# Altium project BMS_Link_Rev0.PrjPcb
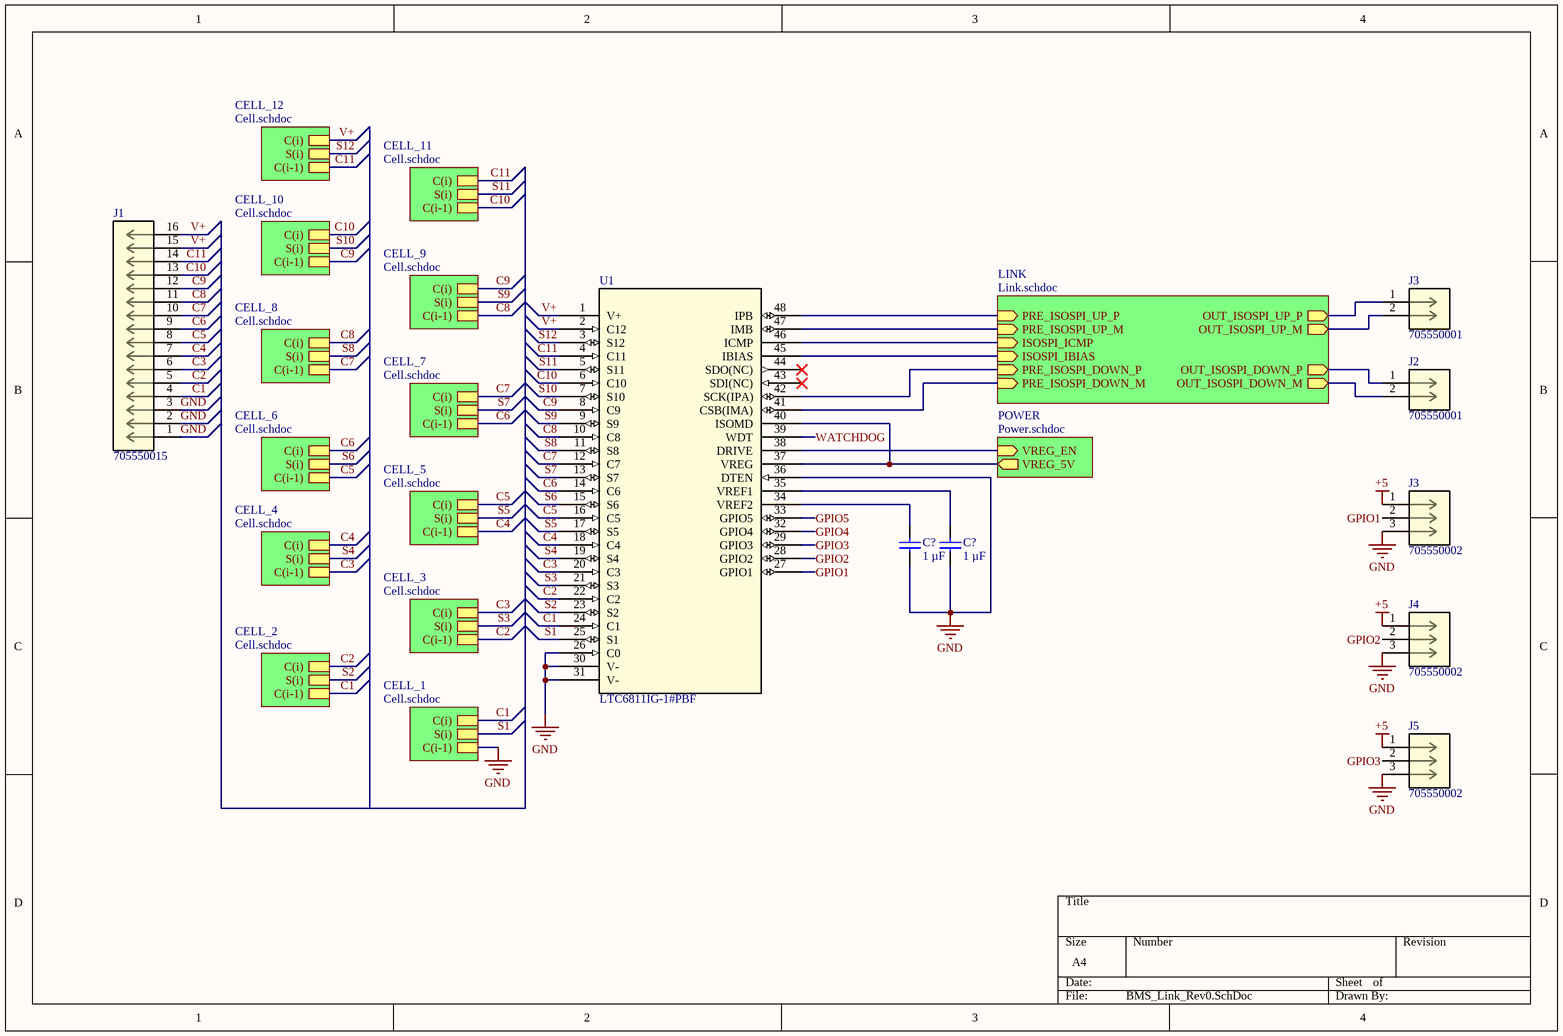
[diagram p0: BMS_Link_Rev0.SchDoc]
4 sheets, 101 parts. Net scope: hierarchical (ports join the sheet entries above them; power ports are global).
Board file: BMS_Link_Rev0.PcbDoc
Sheets:
  BMS_Link_Rev0.SchDoc
    CELL_11 = Cell.SchDoc
    CELL_9 = Cell.SchDoc
    CELL_7 = Cell.SchDoc
    CELL_5 = Cell.SchDoc
    CELL_3 = Cell.SchDoc
    CELL_1 = Cell.SchDoc
    CELL_12 = Cell.SchDoc
    CELL_10 = Cell.SchDoc
    CELL_8 = Cell.SchDoc
    CELL_6 = Cell.SchDoc
    CELL_4 = Cell.SchDoc
    CELL_2 = Cell.SchDoc
    POWER = Power.SchDoc
    LINK = Link.SchDoc

## Sheet BMS_Link_Rev0.SchDoc
size A4; SheetNumber: 1; SheetTotal: 3

### Parts
(Parts that share a designator on the sheet are numbered #1, #2 ... from top to bottom, then left to right.)
C?#1  value 1 µF  [0805_CAPACITOR]  (hidden comment: CL21B105KAFNNNE)
C?#2  value 1 µF  [0805_CAPACITOR]  (hidden comment: CL21B105KAFNNNE)
J1  705550015  [MOLEX-CON-16P-705550000]
J2  705550001  [CONN_705550000-SD_02_MOL]
J3#1  705550001  [CONN_705550000-SD_02_MOL]
J3#2  705550002  [CONN_705550000-SD_03_MOL]
J4  705550002  [CONN_705550000-SD_03_MOL]
J5  705550002  [CONN_705550000-SD_03_MOL]
U1  LTC6811IG-1#PBF  [48-SSOP]

### Sub-sheets
CELL_1 = Cell.schdoc: C(i), C(i-1), S(i)
CELL_2 = Cell.schdoc: C(i), C(i-1), S(i)
CELL_3 = Cell.schdoc: C(i), C(i-1), S(i)
CELL_4 = Cell.schdoc: C(i), C(i-1), S(i)
CELL_5 = Cell.schdoc: C(i), C(i-1), S(i)
CELL_6 = Cell.schdoc: C(i), C(i-1), S(i)
CELL_7 = Cell.schdoc: C(i), C(i-1), S(i)
CELL_8 = Cell.schdoc: C(i), C(i-1), S(i)
CELL_9 = Cell.schdoc: C(i), C(i-1), S(i)
CELL_10 = Cell.schdoc: C(i), C(i-1), S(i)
CELL_11 = Cell.schdoc: C(i), C(i-1), S(i)
CELL_12 = Cell.schdoc: C(i), C(i-1), S(i)
LINK = Link.schdoc: PRE_ISOSPI_UP_P (in), PRE_ISOSPI_UP_M (in), ISOSPI_ICMP (in), ISOSPI_IBIAS (in), PRE_ISOSPI_DOWN_P (in), PRE_ISOSPI_DOWN_M (in), OUT_ISOSPI_UP_P (out), OUT_ISOSPI_UP_M (out), OUT_ISOSPI_DOWN_P (out), OUT_ISOSPI_DOWN_M (out)
POWER = Power.schdoc: VREG_EN (in), VREG_5V (out)

### Nets
+5: J3#2.1 J4.1 J5.1 U1.37(VREG) U1.40(ISOMD) ; sheet POWER/VREG_5V
GND: C?#1.2 C?#2.2 J1.1 J1.2 J1.3 J3#2.3 J4.3 J5.3 U1.26(C0) U1.30(V-) U1.31(V-) U1.36(DTEN) ; sheet CELL_1/C(i-1)
C1: J1.4 U1.24(C1) ; sheet CELL_1/C(i), sheet CELL_2/C(i-1)
C2: J1.5 U1.22(C2) ; sheet CELL_3/C(i-1), sheet CELL_2/C(i)
C3: J1.6 U1.20(C3) ; sheet CELL_3/C(i), sheet CELL_4/C(i-1)
C4: J1.7 U1.18(C4) ; sheet CELL_5/C(i-1), sheet CELL_4/C(i)
C5: J1.8 U1.16(C5) ; sheet CELL_5/C(i), sheet CELL_6/C(i-1)
C6: J1.9 U1.14(C6) ; sheet CELL_7/C(i-1), sheet CELL_6/C(i)
C7: J1.10 U1.12(C7) ; sheet CELL_7/C(i), sheet CELL_8/C(i-1)
C8: J1.11 U1.10(C8) ; sheet CELL_9/C(i-1), sheet CELL_8/C(i)
C9: J1.12 U1.8(C9) ; sheet CELL_9/C(i), sheet CELL_10/C(i-1)
C10: J1.13 U1.6(C10) ; sheet CELL_11/C(i-1), sheet CELL_10/C(i)
C11: J1.14 U1.4(C11) ; sheet CELL_11/C(i), sheet CELL_12/C(i-1)
GPIO1: J3#2.2 U1.27(GPIO1)
GPIO2: J4.2 U1.28(GPIO2)
GPIO3: J5.2 U1.29(GPIO3)
GPIO4: U1.32(GPIO4)
GPIO5: U1.33(GPIO5)
ISOSPI_IBIAS: U1.45(IBIAS) ; sheet LINK/ISOSPI_IBIAS
ISOSPI_ICMP: U1.46(ICMP) ; sheet LINK/ISOSPI_ICMP
PRE_ISOSPI_DOWN_M: J2.2 U1.41(CSB(IMA)) ; sheet LINK/PRE_ISOSPI_DOWN_M, sheet LINK/OUT_ISOSPI_DOWN_M
PRE_ISOSPI_DOWN_P: J2.1 U1.42(SCK(IPA)) ; sheet LINK/PRE_ISOSPI_DOWN_P, sheet LINK/OUT_ISOSPI_DOWN_P
PRE_ISOSPI_UP_M: J3#1.2 U1.47(IMB) ; sheet LINK/PRE_ISOSPI_UP_M, sheet LINK/OUT_ISOSPI_UP_M
PRE_ISOSPI_UP_P: J3#1.1 U1.48(IPB) ; sheet LINK/PRE_ISOSPI_UP_P, sheet LINK/OUT_ISOSPI_UP_P
S1: U1.25(S1) ; sheet CELL_1/S(i)
S2: U1.23(S2) ; sheet CELL_2/S(i)
S3: U1.21(S3) ; sheet CELL_3/S(i)
S4: U1.19(S4) ; sheet CELL_4/S(i)
S5: U1.17(S5) ; sheet CELL_5/S(i)
S6: U1.15(S6) ; sheet CELL_6/S(i)
S7: U1.13(S7) ; sheet CELL_7/S(i)
S8: U1.11(S8) ; sheet CELL_8/S(i)
S9: U1.9(S9) ; sheet CELL_9/S(i)
S10: U1.7(S10) ; sheet CELL_10/S(i)
S11: U1.5(S11) ; sheet CELL_11/S(i)
S12: U1.3(S12) ; sheet CELL_12/S(i)
V+: J1.15 J1.16 U1.1(V+) U1.2(C12) ; sheet CELL_12/C(i)
WATCHDOG: U1.39(WDT)
NetC?#1_1: C?#1.1 U1.34(VREF2)
NetC?#2_1: C?#2.1 U1.35(VREF1)
NetU1_38: U1.38(DRIVE) ; sheet POWER/VREG_EN

Not connected (* = marked no-connect by the designer): U1 43(SDI(NC))* 44(SDO(NC))*

### Library data of the parts
C?#1 C?#2 = CL21B105KAFNNNE: 1 µF ±10% 25V Ceramic Capacitor X7R 0805 (2012 Metric)
J1 = 705550015: 2.54mm Pitch SL Header, Single Row, Right Angle, 3.05mm Pocket, Shrouded, with Press-fit Plastic Peg, 16 Circuits, Tin (Sn) Plating; Manufacturer_Name: Molex Connector Corporation; Copyright: Copyright (C) 2025 Ultra Librarian. All rights reserved.; Manufacturer_Part_Number: 705550015; Datasheet: https://www.molex.com/en-us/products/part-detail-pdf/705550015?display=pdf; RefDes: RefDes; Type: Type
J2 J3#1 = 705550001: 2.54mm Pitch SL Header, Single Row, Right Angle, 3.05mm Pocket, Shrouded, with Press-fit Plastic Peg, 2 Circuits, Tin (Sn) Plating; Manufacturer_Name: Molex Connector Corporation; Copyright: Copyright (C) 2025 Ultra Librarian. All rights reserved.; Manufacturer_Part_Number: 705550001; Datasheet: https://www.molex.com/en-us/products/part-detail-pdf/705550001?display=pdf; RefDes: RefDes; Type: Type
J3#2 J4 J5 = 705550002: 2.54mm Pitch SL Header, Single Row, Right Angle, 3.05mm Pocket, Shrouded, with Press-fit Plastic Peg, 3 Circuits, Tin (Sn) Plating; Manufacturer_Name: Molex Connector Corporation; Copyright: Copyright (C) 2025 Ultra Librarian. All rights reserved.; Manufacturer_Part_Number: 705550002; Datasheet: https://www.molex.com/en-us/products/part-detail-pdf/705550002?display=pdf; RefDes: RefDes; Type: Type
U1 = LTC6811IG-1PBF: 12 Channel Multicell Battery Monitor with Daisy Chain Interface, Generation 4; Manufacturer_Name: Analog Devices Inc; Type: Power Management; Copyright: Copyright (C) 2025 Ultra Librarian. All rights reserved.; Manufacturer_Part_Number: LTC6811IG-1#PBF; Datasheet: https://www.analog.com/media/en/technical-documentation/data-sheets/LTC6811-1-6811-2.pdf; RefDes: RefDes

## Sheet Cell.SchDoc
size A4; SheetNumber: 3; SheetTotal: 4
Used 12 times, as channels CELL_11, CELL_9, CELL_7, CELL_5, CELL_3, CELL_1, CELL_12, CELL_10, CELL_8, CELL_6, CELL_4, CELL_2. Parts and nets are listed once, with the designators drawn on the sheet.
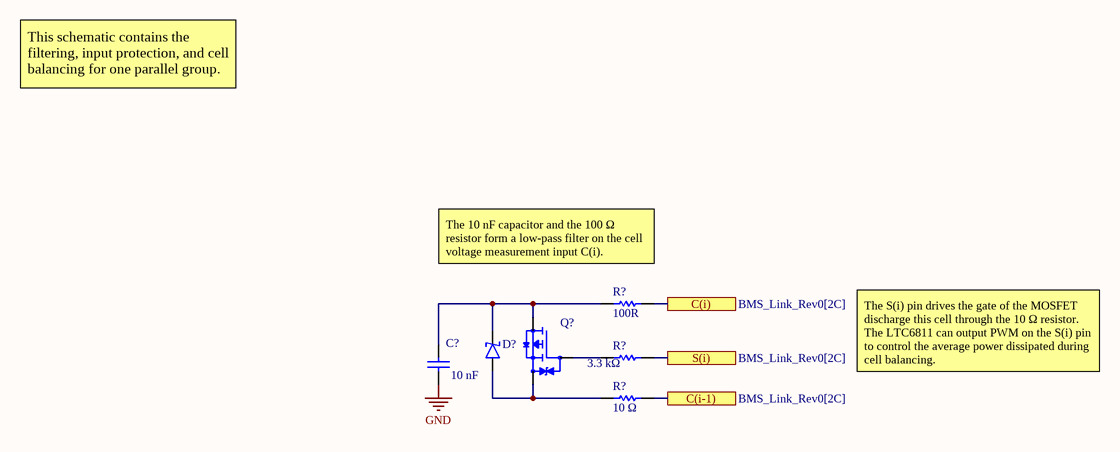
[diagram p1: Cell.SchDoc]

### Parts
(Parts that share a designator on the sheet are numbered #1, #2 ... from top to bottom, then left to right.)
C?  value 10 nF  [0805_CAPACITOR]  (hidden comment: CL21B103KBANNNC)
D?  SMAZ6V8-13-F  [SMA_DO-214AC_DIODE]  (value not drawn)
Q?  BSS308PE  [TRANS_SOT23]  (value not drawn)
R?#1  value 100R  [0805_RESISTOR]  (hidden comment: ERA-6AEB101V)
R?#2  value 3.3 kΩ  [0805_RESISTOR]  (hidden comment: RC0805FR-073K3L)
R?#3  value 10 Ω  [RES_3540_TEC-M]  (hidden comment: 354010RFT)

### Ports
C(i) (see BMS_Link_Rev0[2C]), C(i-1) (see BMS_Link_Rev0[2C]), S(i) (see BMS_Link_Rev0[2C])

### Nets
GND: C?.2
C(i): R?#1.2 ; port C(i)
C(i-1): R?#3.1 ; port C(i-1)
S(i): R?#2.1 ; port S(i)
NetC?_1: C?.1 D?.2(K) Q?.3(D) R?#1.1
NetD?_1: D?.1(A) Q?.2(S) R?#3.2
NetQ?_1: Q?.1(G) R?#2.2

### Channels
CELL_11: designators C?=C?_1 D?=D?_1 Q?=Q?_1 R?=R?_1#3 R?=R?_1#1 R?=R?_1#2; ports C(i)=C11 C(i-1)=C10 S(i)=S11
CELL_9: designators C?=C?_2 D?=D?_2 Q?=Q?_2 R?=R?_2#3 R?=R?_2#1 R?=R?_2#2; ports C(i)=C9 C(i-1)=C8 S(i)=S9
CELL_7: designators C?=C?_3 D?=D?_3 Q?=Q?_3 R?=R?_3#3 R?=R?_3#1 R?=R?_3#2; ports C(i)=C7 C(i-1)=C6 S(i)=S7
CELL_5: designators C?=C?_4 D?=D?_4 Q?=Q?_4 R?=R?_4#3 R?=R?_4#1 R?=R?_4#2; ports C(i)=C5 C(i-1)=C4 S(i)=S5
CELL_3: designators C?=C?_5 D?=D?_5 Q?=Q?_5 R?=R?_5#3 R?=R?_5#1 R?=R?_5#2; ports C(i)=C3 C(i-1)=C2 S(i)=S3
CELL_1: designators C?=C?_6 D?=D?_6 Q?=Q?_6 R?=R?_6#3 R?=R?_6#1 R?=R?_6#2; ports C(i)=C1 C(i-1)=GND S(i)=S1
CELL_12: designators C?=C?_7 D?=D?_7 Q?=Q?_7 R?=R?_7#3 R?=R?_7#1 R?=R?_7#2; ports C(i)=V+ C(i-1)=C11 S(i)=S12
CELL_10: designators C?=C?_8 D?=D?_8 Q?=Q?_8 R?=R?_8#3 R?=R?_8#1 R?=R?_8#2; ports C(i)=C10 C(i-1)=C9 S(i)=S10
CELL_8: designators C?=C?_9 D?=D?_9 Q?=Q?_9 R?=R?_9#3 R?=R?_9#1 R?=R?_9#2; ports C(i)=C8 C(i-1)=C7 S(i)=S8
CELL_6: designators C?=C?_10 D?=D?_10 Q?=Q?_10 R?=R?_10#3 R?=R?_10#1 R?=R?_10#2; ports C(i)=C6 C(i-1)=C5 S(i)=S6
CELL_4: designators C?=C?_11 D?=D?_11 Q?=Q?_11 R?=R?_11#3 R?=R?_11#1 R?=R?_11#2; ports C(i)=C4 C(i-1)=C3 S(i)=S4
CELL_2: designators C?=C?_12 D?=D?_12 Q?=Q?_12 R?=R?_12#3 R?=R?_12#1 R?=R?_12#2; ports C(i)=C2 C(i-1)=C1 S(i)=S2

### Notes on the sheet
- This schematic contains the filtering, input protection, and cell balancing for one parallel group.
- (near R?#1) The 10 nF capacitor and the 100 Ω resistor form a low-pass filter on the cell voltage measurement input C(i).
- The S(i) pin drives the gate of the MOSFET discharge this cell through the 10 Ω resistor. The LTC6811 can output PWM on the S(i) pin to control the average power dissipated during cell balancing.

### Library data of the parts
C? = CL21B103KBANNNC: 10 nF ±10% 50V Ceramic Capacitor X7R 0805 (2012 Metric)
D? = SMAZ6V8-13-F: Zener Diode 6.8 V 1 W ±5% Surface Mount SMA DO-214AC
Q? = BSS308PE: P-Channel 30 V 2A (Ta) 500mW (Ta) Surface Mount PG-SOT23; MF: Infineon; SnapEDA_Link: https://www.snapeda.com/parts/BSS308PE/Infineon/view-part/?ref=snap; Package: SOT-23 Infineon Technologies; Value: *; MP: BSS308PE; Check_prices: https://www.snapeda.com/parts/BSS308PE/Infineon/view-part/?ref=eda
R?#1 = ERA-6AEB101V: 100 Ohms ±0.1% 0.125W, 1/8W Chip Resistor 0805 (2012 Metric) Automotive AEC-Q200 Thin Film
R?#2 = RC0805FR-073K3L: 3.3 kOhms ±1% 0.125W, 1/8W Chip Resistor 0805 (2012 Metric) Moisture Resistant Thick Film
R?#3 = 354010RFT: 3540 10R 1%

## Sheet Power.SchDoc: BMS Link Power
size A4; Organization: SFU Team Phantom; SheetNumber: 2; SheetTotal: 3
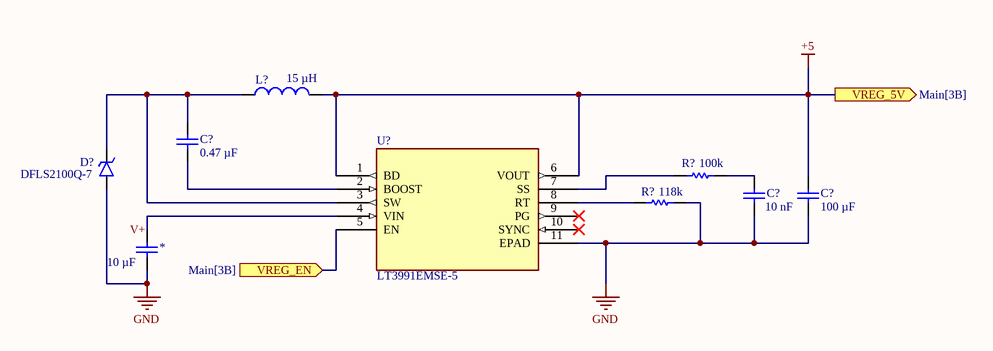
[diagram p2: Power.SchDoc]

### Parts
(Parts that share a designator on the sheet are numbered #1, #2 ... from top to bottom, then left to right.)
*  value 10 µF  [1210_CAPACITOR]  (hidden comment: CL32B106KMVNNWE)
C?#3  value 0.47 µF  [0805_CAPACITOR]  (hidden comment: CC0805JKX7R9BB474)
C?#4  value 10 nF  [0805_CAPACITOR]  (hidden comment: CL21B103KBANNNC)
C?#5  value 100 µF  [WCAP-ASLI_6.3X5.5(DXL)]  (hidden comment: 865080343009)
D?  DFLS2100Q-7  [POWERDI123_DIO_ABR-M]
L?  value 15 µH  [IND_VLS6045EX-150M]  (hidden comment: VLS6045EX-150M)
R?#1  value 100k  [0805_RESISTOR]  (hidden comment: ERJ-6ENF1003V)
R?#2  value 118k  [0805_RESISTOR]  (hidden comment: ERA6AEB1183V)
U?#1  LT3991EMSE-5  [MSOP-10_MSE]

### Ports
VREG_5V (out, see Main[3B]), VREG_EN (in, see Main[3B])

### Nets
+5: C?#5.1 L?.2 U?#1.1(BD) U?#1.6(VOUT) ; port VREG_5V
GND: *.2 C?#4.2 C?#5.2 D?.1(A) R?#2.2 U?#1.11(EPAD)
V+: *.1 U?#1.4(VIN)
NetC?#3_1: C?#3.1 D?.2(K) L?.1 U?#1.3(SW)
NetC?#3_2: C?#3.2 U?#1.2(BOOST)
NetC?#4_1: C?#4.1 R?#1.2
NetR?#1_1: R?#1.1 U?#1.7(SS)
NetR?#2_1: R?#2.1 U?#1.8(RT)
NetU1_38: U?#1.5(EN) ; port VREG_EN

Not connected (* = marked no-connect by the designer): U?#1 9(PG)* 10(SYNC)*

### Library data of the parts
* = CL32B106KMVNNWE: 10 µF ±10% 63V Ceramic Capacitor X7R 1210 (3225 Metric)
C?#3 = CC0805JKX7R9BB474: 0.47 µF ±5% 50V Ceramic Capacitor X7R 0805 (2012 Metric)
C?#4 = CL21B103KBANNNC: as C? on sheet Cell
C?#5 = 865080343009: 100 µF 16 V Aluminum Electrolytic Capacitors Radial, Can - SMD 2000 Hrs @ 105°C
D? = DFLS2100Q-7: Diode 100 V 2A Surface Mount PowerDI™ 123; Manufacturer_Name: Diodes Inc; Copyright: Copyright (C) 2025 Ultra Librarian. All rights reserved.; Manufacturer_Part_Number: DFLS2100Q-7
L? = VLS6045EX-150M: 15 µH Shielded Drum Core, Wirewound Inductor 2.5 A 75mOhm Nonstandard
R?#1 = ERJ-6ENF1003V: 100 kOhms ±1% 0.125W, 1/8W Chip Resistor 0805 (2012 Metric) Automotive AEC-Q200 Thick Film
R?#2 = ERA6AEB1183V: 118 kOhms ±0.1% 0.125W, 1/8W Chip Resistor 0805 (2012 Metric) Automotive AEC-Q200 Thin Film; MP: ERA6AEB1183V; Package: None; Availability: Unavailable; Price: None
U?#1 = LT3991EMSE-5: 55V, 1.2A Step-Down Regulator with 2.8 uA Quiescent Current; MF: Analog Devices; MP: LT3991EMSE-5#PBF; Value: *; Package: MSOP -10 Analog Devices; Digi-Key_Part_Number: LT3991EMSE-5#PBF-ND; Check_prices: https://www.snapeda.com/parts/LT3991EMSE-5%23PBF/Analog+Devices/view-part/?ref=eda; SnapEDA_Link: https://www.snapeda.com/parts/LT3991EMSE-5%23PBF/Analog+Devices/view-part/?ref=snap; Purchase-URL: https://pricing.snapeda.com/search/part/LT3991EMSE-5#PBF/?ref=eda

## Sheet Link.SchDoc
size A4; SheetNumber: 4; SheetTotal: 4
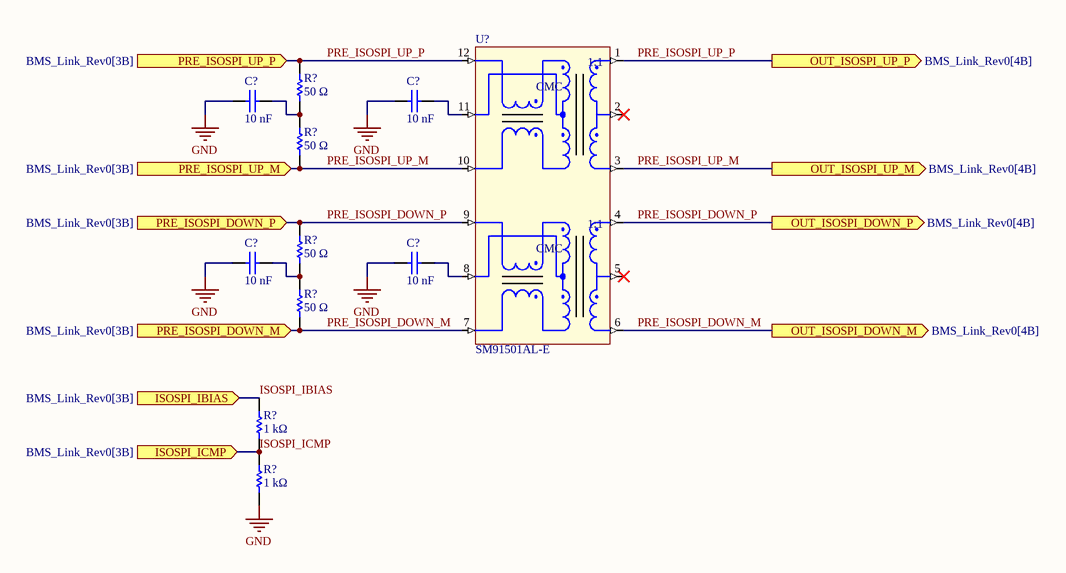
[diagram p3: Link.SchDoc]

### Parts
(Parts that share a designator on the sheet are numbered #1, #2 ... from top to bottom, then left to right.)
C?#6  value 10 nF  [0805_CAPACITOR]  (hidden comment: CL21B103KBANNNC)
C?#7  value 10 nF  [0805_CAPACITOR]  (hidden comment: CL21B103KBANNNC)
C?#8  value 10 nF  [0805_CAPACITOR]  (hidden comment: CL21B103KBANNNC)
C?#9  value 10 nF  [0805_CAPACITOR]  (hidden comment: CL21B103KBANNNC)
R?#3  value 50 Ω  [0805_RESISTOR]  (hidden comment: RT0805BRB0750RL)
R?#4  value 50 Ω  [0805_RESISTOR]  (hidden comment: RT0805BRB0750RL)
R?#5  value 50 Ω  [0805_RESISTOR]  (hidden comment: RT0805BRB0750RL)
R?#6  value 50 Ω  [0805_RESISTOR]  (hidden comment: RT0805BRB0750RL)
R?#7  value 1 kΩ  [0805_RESISTOR]  (hidden comment: ERA-6AEB102V)
R?#8  value 1 kΩ  [0805_RESISTOR]  (hidden comment: ERA-6AEB102V)
U?#2  SM91501AL-E  [SOP200P1473X500-12N]

### Ports
ISOSPI_IBIAS (in, see BMS_Link_Rev0[3B]), ISOSPI_ICMP (in, see BMS_Link_Rev0[3B]), OUT_ISOSPI_DOWN_M (out, see BMS_Link_Rev0[4B]), OUT_ISOSPI_DOWN_P (out, see BMS_Link_Rev0[4B]), OUT_ISOSPI_UP_M (out, see BMS_Link_Rev0[4B]), OUT_ISOSPI_UP_P (out, see BMS_Link_Rev0[4B]), PRE_ISOSPI_DOWN_M (in, see BMS_Link_Rev0[3B]), PRE_ISOSPI_DOWN_P (in, see BMS_Link_Rev0[3B]), PRE_ISOSPI_UP_M (in, see BMS_Link_Rev0[3B]), PRE_ISOSPI_UP_P (in, see BMS_Link_Rev0[3B])

### Nets
GND: C?#6.1 C?#7.1 C?#8.1 C?#9.1 R?#8.2
ISOSPI_IBIAS: R?#7.1 ; port ISOSPI_IBIAS
ISOSPI_ICMP: R?#7.2 R?#8.1 ; port ISOSPI_ICMP
PRE_ISOSPI_DOWN_M: R?#6.2 U?#2.6 U?#2.7 ; port PRE_ISOSPI_DOWN_M, port OUT_ISOSPI_DOWN_M
PRE_ISOSPI_DOWN_P: R?#5.1 U?#2.4 U?#2.9 ; port PRE_ISOSPI_DOWN_P, port OUT_ISOSPI_DOWN_P
PRE_ISOSPI_UP_M: R?#4.2 U?#2.3 U?#2.10 ; port PRE_ISOSPI_UP_M, port OUT_ISOSPI_UP_M
PRE_ISOSPI_UP_P: R?#3.1 U?#2.1 U?#2.12 ; port PRE_ISOSPI_UP_P, port OUT_ISOSPI_UP_P
NetC?#6_2: C?#6.2 R?#3.2 R?#4.1
NetC?#7_2: C?#7.2 U?#2.11
NetC?#8_2: C?#8.2 R?#5.2 R?#6.1
NetC?#9_2: C?#9.2 U?#2.8

Not connected (* = marked no-connect by the designer): U?#2 2* 5*

### Notes on the sheet
- (in symbol SM91501AL-E) 1:1; CMC

### Library data of the parts
C?#6-C?#9 = CL21B103KBANNNC: as C? on sheet Cell
R?#3-R?#6 = RT0805BRB0750RL: 50 Ohms ±0.1% 0.125W, 1/8W Chip Resistor 0805 (2012 Metric) Moisture Resistant Thin Film
R?#7 R?#8 = ERA-6AEB102V: 1 kOhms ±0.1% 0.125W, 1/8W Chip Resistor 0805 (2012 Metric) Automotive AEC-Q200 Thin Film
U?#2 = SM91501AL-E: 150µH Pulse Transformer 1CT:1CT Surface Mount

## Nets that join several sheets
+5: BMS_Link_Rev0 (5 pins), Power (C?#5.1 L?.2 U?#1.1 U?#1.6)
GND: BMS_Link_Rev0 (12 pins), CELL_11 (C?_1.2), CELL_9 (C?_2.2), CELL_7 (C?_3.2), CELL_5 (C?_4.2), CELL_3 (C?_5.2), CELL_1 (C?_6.2 R?_6#3.1), CELL_12 (C?_7.2), CELL_10 (C?_8.2), CELL_8 (C?_9.2), CELL_6 (C?_10.2), CELL_4 (C?_11.2), CELL_2 (C?_12.2), Power (6 pins), Link (5 pins)
C1: BMS_Link_Rev0 (J1.4 U1.24), CELL_1 (R?_6#1.2), CELL_2 (R?_12#3.1)
C2: BMS_Link_Rev0 (J1.5 U1.22), CELL_3 (R?_5#3.1), CELL_2 (R?_12#1.2)
C3: BMS_Link_Rev0 (J1.6 U1.20), CELL_3 (R?_5#1.2), CELL_4 (R?_11#3.1)
C4: BMS_Link_Rev0 (J1.7 U1.18), CELL_5 (R?_4#3.1), CELL_4 (R?_11#1.2)
C5: BMS_Link_Rev0 (J1.8 U1.16), CELL_5 (R?_4#1.2), CELL_6 (R?_10#3.1)
C6: BMS_Link_Rev0 (J1.9 U1.14), CELL_7 (R?_3#3.1), CELL_6 (R?_10#1.2)
C7: BMS_Link_Rev0 (J1.10 U1.12), CELL_7 (R?_3#1.2), CELL_8 (R?_9#3.1)
C8: BMS_Link_Rev0 (J1.11 U1.10), CELL_9 (R?_2#3.1), CELL_8 (R?_9#1.2)
C9: BMS_Link_Rev0 (J1.12 U1.8), CELL_9 (R?_2#1.2), CELL_10 (R?_8#3.1)
C10: BMS_Link_Rev0 (J1.13 U1.6), CELL_11 (R?_1#3.1), CELL_10 (R?_8#1.2)
C11: BMS_Link_Rev0 (J1.14 U1.4), CELL_11 (R?_1#1.2), CELL_12 (R?_7#3.1)
ISOSPI_IBIAS: BMS_Link_Rev0 (U1.45), Link (R?#7.1)
ISOSPI_ICMP: BMS_Link_Rev0 (U1.46), Link (R?#7.2 R?#8.1)
NetU1_38: BMS_Link_Rev0 (U1.38), Power (U?#1.5)
PRE_ISOSPI_DOWN_M: BMS_Link_Rev0 (J2.2 U1.41), Link (R?#6.2 U?#2.6 U?#2.7)
PRE_ISOSPI_DOWN_P: BMS_Link_Rev0 (J2.1 U1.42), Link (R?#5.1 U?#2.4 U?#2.9)
PRE_ISOSPI_UP_M: BMS_Link_Rev0 (J3#1.2 U1.47), Link (R?#4.2 U?#2.3 U?#2.10)
PRE_ISOSPI_UP_P: BMS_Link_Rev0 (J3#1.1 U1.48), Link (R?#3.1 U?#2.1 U?#2.12)
S1: BMS_Link_Rev0 (U1.25), CELL_1 (R?_6#2.1)
S2: BMS_Link_Rev0 (U1.23), CELL_2 (R?_12#2.1)
S3: BMS_Link_Rev0 (U1.21), CELL_3 (R?_5#2.1)
S4: BMS_Link_Rev0 (U1.19), CELL_4 (R?_11#2.1)
S5: BMS_Link_Rev0 (U1.17), CELL_5 (R?_4#2.1)
S6: BMS_Link_Rev0 (U1.15), CELL_6 (R?_10#2.1)
S7: BMS_Link_Rev0 (U1.13), CELL_7 (R?_3#2.1)
S8: BMS_Link_Rev0 (U1.11), CELL_8 (R?_9#2.1)
S9: BMS_Link_Rev0 (U1.9), CELL_9 (R?_2#2.1)
S10: BMS_Link_Rev0 (U1.7), CELL_10 (R?_8#2.1)
S11: BMS_Link_Rev0 (U1.5), CELL_11 (R?_1#2.1)
S12: BMS_Link_Rev0 (U1.3), CELL_12 (R?_7#2.1)
V+: BMS_Link_Rev0 (J1.15 J1.16 U1.1 U1.2), CELL_12 (R?_7#1.2)